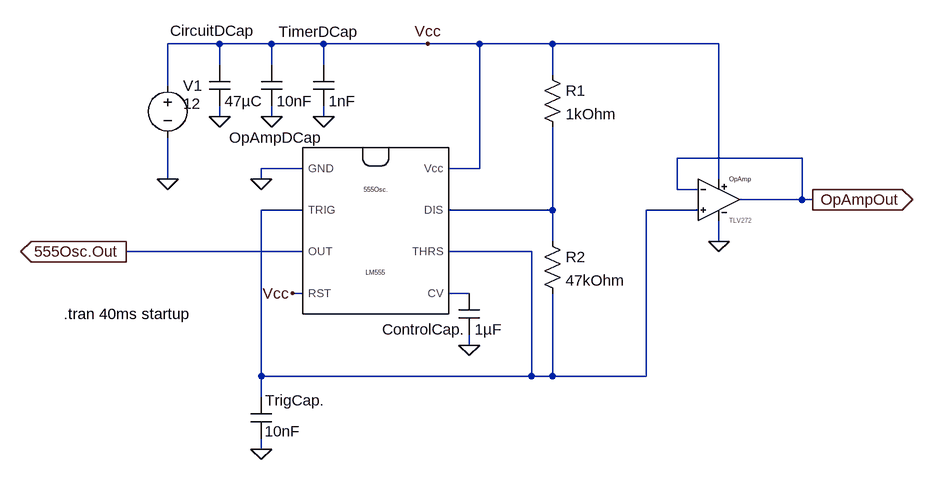
[diagram p0: schematic 555oneshot.asc]
555oneshot.asc, the LTspice schematic file:
Version 4
SHEET 1 1276 724
WIRE -160 80 -240 80
WIRE -80 80 -160 80
WIRE 0 80 -80 80
WIRE 160 80 0 80
WIRE 240 80 160 80
WIRE 352 80 240 80
WIRE 608 80 352 80
WIRE -160 112 -160 80
WIRE -80 112 -80 80
WIRE 0 112 0 80
WIRE 352 128 352 80
WIRE -240 144 -240 80
WIRE -160 192 -160 176
WIRE -80 192 -80 176
WIRE 0 192 0 176
WIRE 736 256 544 256
WIRE -32 272 -96 272
WIRE 240 272 240 80
WIRE 240 272 192 272
WIRE -240 288 -240 224
WIRE -96 288 -96 272
WIRE 608 288 608 80
WIRE 544 304 544 256
WIRE 576 304 544 304
WIRE 736 320 736 256
WIRE 736 320 640 320
WIRE 752 320 736 320
WIRE -32 336 -96 336
WIRE 352 336 352 208
WIRE 352 336 192 336
WIRE 576 336 496 336
WIRE 352 384 352 336
WIRE 608 384 608 352
WIRE -32 400 -304 400
WIRE 320 400 192 400
WIRE -32 464 -48 464
WIRE 224 464 192 464
WIRE 224 544 224 528
WIRE -96 592 -96 336
WIRE 320 592 320 400
WIRE 320 592 -96 592
WIRE 352 592 352 464
WIRE 352 592 320 592
WIRE 496 592 496 336
WIRE 496 592 352 592
WIRE -96 624 -96 592
WIRE -96 704 -96 688
FLAG -240 288 0
FLAG -96 288 0
FLAG 224 544 0
FLAG -96 704 0
FLAG 160 80 Vcc
FLAG 608 384 0
FLAG 752 320 OpAmpOut
IOPIN 752 320 Out
FLAG -304 400 555Osc.Out
IOPIN -304 400 Out
FLAG -48 464 Vcc
FLAG -160 192 0
FLAG -80 192 0
FLAG 0 192 0
SYMBOL LM555 80 368 R0
SYMATTR InstName 555Osc.
SYMBOL TL272 608 320 R0
SYMATTR InstName OpAmp
SYMBOL voltage -240 128 R0
WINDOW 3 24 44 Left 2
WINDOW 123 0 0 Left 2
WINDOW 39 0 0 Left 2
SYMATTR Value 12
SYMATTR InstName V1
SYMBOL cap 208 464 R0
WINDOW 0 -118 56 Left 2
SYMATTR InstName ControlCap.
SYMATTR Value 1µF
SYMBOL cap -112 624 R0
WINDOW 0 22 5 Left 2
WINDOW 3 21 53 Left 2
SYMATTR InstName TrigCap.
SYMATTR Value 10nF
SYMBOL res 336 112 R0
SYMATTR InstName R1
SYMATTR Value 1kOhm
SYMBOL res 336 368 R0
SYMATTR InstName R2
SYMATTR Value 47kOhm
SYMBOL cap -176 112 R0
WINDOW 0 -60 -52 Left 2
SYMATTR InstName CircuitDCap
SYMATTR Value 47µC
SYMBOL cap -96 112 R0
WINDOW 0 -49 112 Left 2
SYMATTR InstName OpAmpDCap
SYMATTR Value 10nF
SYMBOL cap -16 112 R0
WINDOW 0 -53 -51 Left 2
SYMATTR InstName TimerDCap
SYMATTR Value 1nF
TEXT -400 496 Left 2 !.tran 40ms startup

The netlist it stands for:
* 555oneshot.asc
X555Osc. 0 N001 555Osc.Out Vcc N003 N001 N002 Vcc NE555  ; pins GND TRIG OUT RST CV THRS DIS Vcc
XOpAmp N001 OpAmpOut Vcc 0 OpAmpOut level.2 Avol=1Meg GBW=3Meg Slew=2.4Meg ilimit=20m rail=0.1 Vos=0 phimargin=45 en=0 enk=0 in=0 ink=0 Rin=500Meg  ; pins In+ In- V+ V- OUT
V1 Vcc 0 12
ControlCap. N003 0 1µF
C§TrigCap. N001 0 10nF
R1 Vcc N002 1kOhm
R2 N002 N001 47kOhm
CircuitDCap Vcc 0 47µC
C§OpAmpDCap Vcc 0 10nF
C§TimerDCap Vcc 0 1nF
.tran 40ms startup
.lib NE555.sub
.lib UniversalOpamps2.sub
.backanno
.end